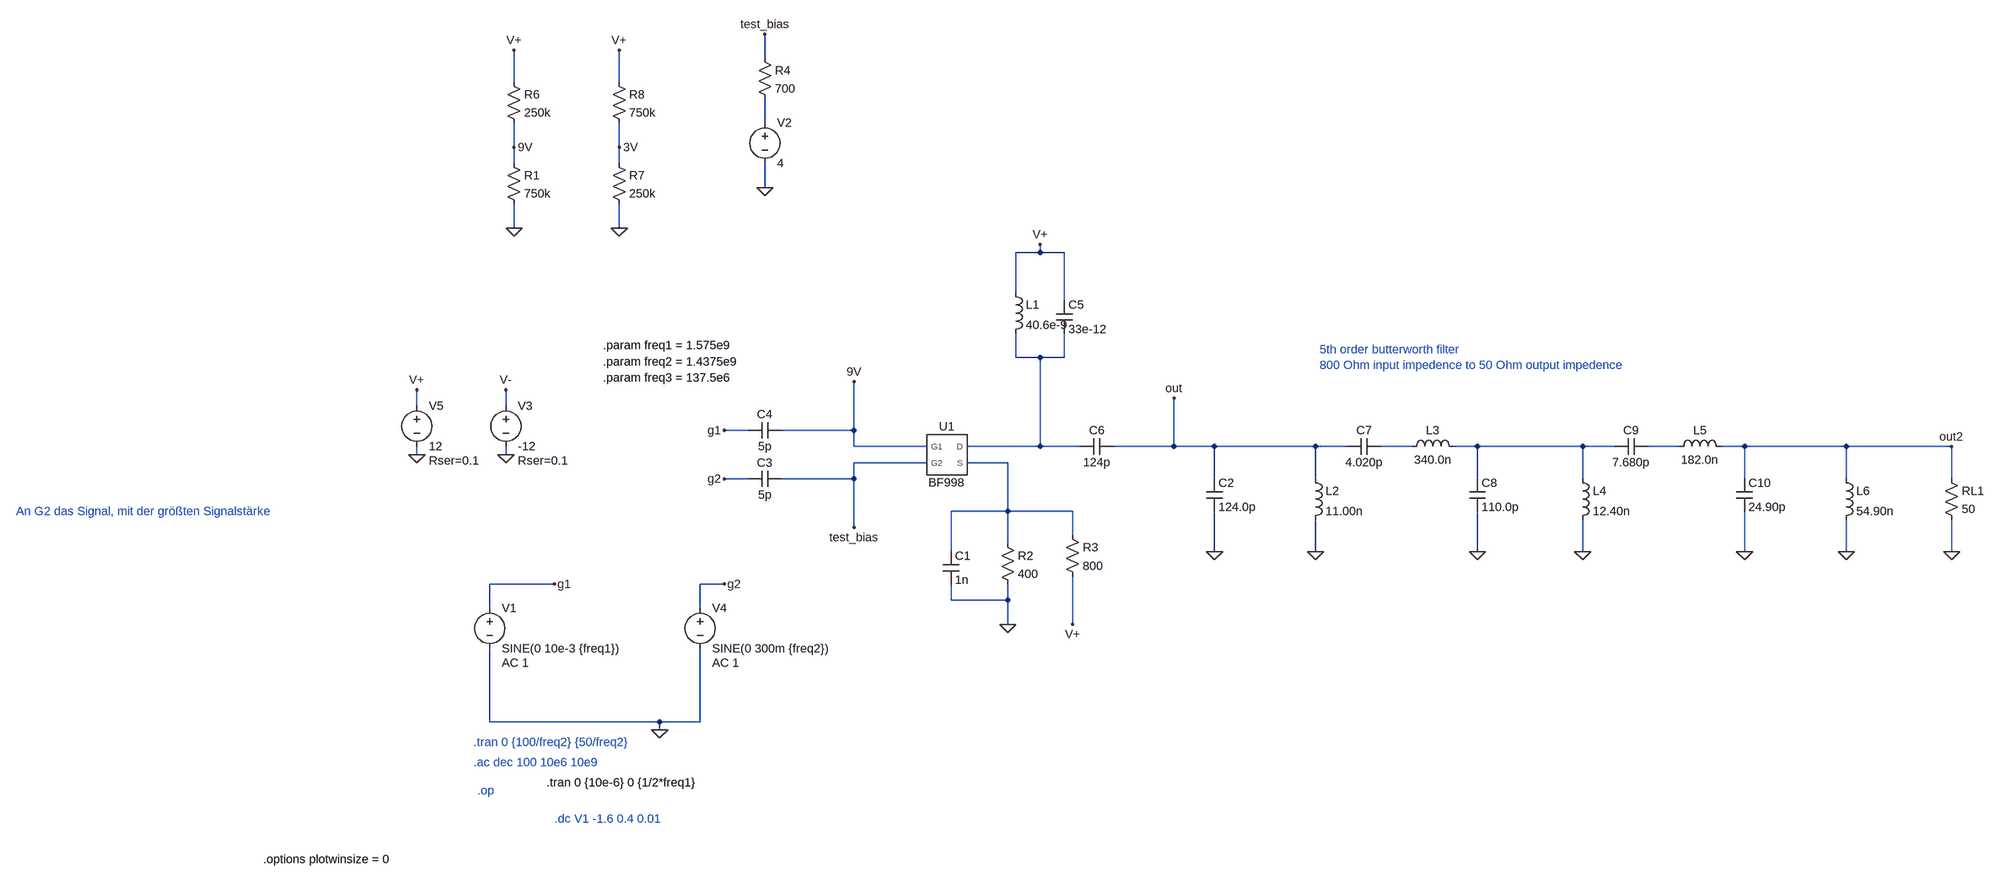
[diagram p0: schematic bf998_2.asc]
bf998_2.asc, the LTspice schematic file:
Version 4
SHEET 1 2012 1520
WIRE -656 -112 -656 -160
WIRE -1152 -64 -1152 -128
WIRE -944 -64 -944 -128
WIRE -656 16 -656 -32
WIRE -1152 64 -1152 16
WIRE -944 64 -944 16
WIRE -1152 96 -1152 64
WIRE -944 96 -944 64
WIRE -656 144 -656 96
WIRE -1152 224 -1152 176
WIRE -944 224 -944 176
WIRE -112 272 -112 256
WIRE -112 272 -160 272
WIRE -64 272 -112 272
WIRE -160 352 -160 272
WIRE -64 368 -64 272
WIRE -160 480 -160 432
WIRE -112 480 -160 480
WIRE -64 480 -64 432
WIRE -64 480 -112 480
WIRE -1344 576 -1344 544
WIRE -1168 576 -1168 544
WIRE -688 624 -736 624
WIRE -480 624 -480 528
WIRE -480 624 -624 624
WIRE -480 656 -480 624
WIRE -336 656 -480 656
WIRE -112 656 -112 480
WIRE -112 656 -256 656
WIRE -32 656 -112 656
WIRE 176 656 176 560
WIRE 176 656 32 656
WIRE 256 656 176 656
WIRE 464 656 256 656
WIRE 528 656 464 656
WIRE 656 656 592 656
WIRE 784 656 736 656
WIRE 992 656 784 656
WIRE 1056 656 992 656
WIRE 1184 656 1120 656
WIRE 1312 656 1264 656
WIRE 1520 656 1312 656
WIRE 1728 656 1520 656
WIRE -1344 672 -1344 656
WIRE -1168 672 -1168 656
WIRE -336 688 -480 688
WIRE -176 688 -256 688
WIRE -688 720 -736 720
WIRE -480 720 -480 688
WIRE -480 720 -624 720
WIRE 256 720 256 656
WIRE 464 720 464 656
WIRE 784 720 784 656
WIRE 992 720 992 656
WIRE 1312 720 1312 656
WIRE 1520 720 1520 656
WIRE 1728 720 1728 656
WIRE -176 784 -176 688
WIRE -176 784 -288 784
WIRE -48 784 -176 784
WIRE -480 816 -480 720
WIRE -48 832 -48 784
WIRE -176 848 -176 784
WIRE -288 864 -288 784
WIRE 256 864 256 784
WIRE 464 864 464 800
WIRE 784 864 784 784
WIRE 992 864 992 800
WIRE 1312 864 1312 784
WIRE 1520 864 1520 800
WIRE 1728 864 1728 800
WIRE -1072 928 -1200 928
WIRE -736 928 -784 928
WIRE -288 960 -288 928
WIRE -176 960 -176 928
WIRE -176 960 -288 960
WIRE -1200 976 -1200 928
WIRE -784 976 -784 928
WIRE -176 1008 -176 960
WIRE -48 1008 -48 912
WIRE -1200 1232 -1200 1056
WIRE -864 1232 -1200 1232
WIRE -784 1232 -784 1056
WIRE -784 1232 -864 1232
WIRE -864 1248 -864 1232
FLAG -864 1248 0
FLAG -1344 672 0
FLAG -1072 928 g1
FLAG -736 928 g2
FLAG 176 560 out
FLAG -736 624 g1
FLAG -1344 544 V+
FLAG -112 256 V+
FLAG -176 1008 0
FLAG -736 720 g2
FLAG -48 1008 V+
FLAG -1152 224 0
FLAG -1152 -128 V+
FLAG -1152 64 9V
FLAG -480 528 9V
FLAG -944 224 0
FLAG -944 -128 V+
FLAG -944 64 3V
FLAG -656 144 0
FLAG -656 -160 test_bias
FLAG -480 816 test_bias
FLAG -1168 672 0
FLAG -1168 544 V-
FLAG 256 864 0
FLAG 464 864 0
FLAG 784 864 0
FLAG 992 864 0
FLAG 1312 864 0
FLAG 1520 864 0
FLAG 1728 864 0
FLAG 1728 656 out2
SYMBOL voltage -1200 960 R0
WINDOW 123 24 124 Left 2
WINDOW 39 0 0 Left 0
SYMATTR Value2 AC 1
SYMATTR InstName V1
SYMATTR Value SINE(0 10e-3 {freq1})
SYMBOL voltage -1344 560 R0
WINDOW 123 0 0 Left 0
WINDOW 39 24 124 Left 2
SYMATTR SpiceLine Rser=0.1
SYMATTR InstName V5
SYMATTR Value 12
SYMBOL BF998 -304 672 R0
SYMATTR InstName U1
SYMBOL res -192 832 R0
SYMATTR InstName R2
SYMATTR Value 400
SYMBOL voltage -784 960 R0
WINDOW 123 24 124 Left 2
WINDOW 39 0 0 Left 0
SYMATTR Value2 AC 1
SYMATTR InstName V4
SYMATTR Value SINE(0 300m {freq2})
SYMBOL res -64 816 R0
SYMATTR InstName R3
SYMATTR Value 800
SYMBOL cap -304 864 R0
SYMATTR InstName C1
SYMATTR Value 1n
SYMBOL cap -624 704 R90
WINDOW 0 0 32 VBottom 2
WINDOW 3 32 32 VTop 2
SYMATTR InstName C3
SYMATTR Value 5p
SYMBOL cap -624 608 R90
WINDOW 0 0 32 VBottom 2
WINDOW 3 32 32 VTop 2
SYMATTR InstName C4
SYMATTR Value 5p
SYMBOL ind -176 336 R0
SYMATTR InstName L1
SYMATTR Value 40.6e-9
SYMBOL cap -80 368 R0
SYMATTR InstName C5
SYMATTR Value 33e-12
SYMBOL res -1168 80 R0
SYMATTR InstName R1
SYMATTR Value 750k
SYMBOL res -1168 -80 R0
SYMATTR InstName R6
SYMATTR Value 250k
SYMBOL res -960 80 R0
SYMATTR InstName R7
SYMATTR Value 250k
SYMBOL res -960 -80 R0
SYMATTR InstName R8
SYMATTR Value 750k
SYMBOL voltage -656 0 R0
WINDOW 123 0 0 Left 0
WINDOW 39 0 0 Left 0
SYMATTR InstName V2
SYMATTR Value 4
SYMBOL res -672 -128 R0
SYMATTR InstName R4
SYMATTR Value 700
SYMBOL voltage -1168 560 R0
WINDOW 123 0 0 Left 0
WINDOW 39 24 124 Left 2
SYMATTR SpiceLine Rser=0.1
SYMATTR InstName V3
SYMATTR Value -12
SYMBOL cap 240 720 R0
SYMATTR InstName C2
SYMATTR Value 124.0p
SYMBOL ind 448 704 R0
SYMATTR InstName L2
SYMATTR Value 11.00n
SYMBOL cap 528 672 R270
WINDOW 0 32 32 VTop 2
WINDOW 3 0 32 VBottom 2
SYMATTR InstName C7
SYMATTR Value 4.020p
SYMBOL ind 640 672 R270
WINDOW 0 32 56 VTop 2
WINDOW 3 5 56 VBottom 2
SYMATTR InstName L3
SYMATTR Value 340.0n
SYMBOL cap 768 720 R0
SYMATTR InstName C8
SYMATTR Value 110.0p
SYMBOL ind 976 704 R0
SYMATTR InstName L4
SYMATTR Value 12.40n
SYMBOL cap 1056 672 R270
WINDOW 0 32 32 VTop 2
WINDOW 3 0 32 VBottom 2
SYMATTR InstName C9
SYMATTR Value 7.680p
SYMBOL ind 1168 672 R270
WINDOW 0 32 56 VTop 2
WINDOW 3 5 56 VBottom 2
SYMATTR InstName L5
SYMATTR Value 182.0n
SYMBOL cap 1296 720 R0
SYMATTR InstName C10
SYMATTR Value 24.90p
SYMBOL ind 1504 704 R0
SYMATTR InstName L6
SYMATTR Value 54.90n
SYMBOL res 1712 704 R0
SYMATTR InstName RL1
SYMATTR Value 50
SYMBOL cap 32 640 R90
WINDOW 0 0 32 VBottom 2
WINDOW 3 32 32 VTop 2
SYMATTR InstName C6
SYMATTR Value 124p
TEXT -976 488 Left 2 !.param freq2 = 1.4375e9
TEXT -976 456 Left 2 !.param freq1 = 1.575e9
TEXT -1232 1272 Left 2 ;.tran 0 {100/freq2} {50/freq2}
TEXT -1232 1312 Left 2 ;.ac dec 100 10e6 10e9
TEXT -1224 1368 Left 2 ;.op
TEXT -976 520 Left 2 !.param freq3 = 137.5e6
TEXT -1088 1352 Left 2 !.tran 0 {10e-6} 0 {1/2*freq1}
TEXT -1072 1424 Left 2 ;.dc V1 -1.6 0.4 0.01
TEXT -2136 784 Left 2 ;An G2 das Signal, mit der größten Signalstärke
TEXT -1648 1504 Left 2 !.options plotwinsize = 0
TEXT 472 464 Left 2 ;5th order butterworth filter\n800 Ohm input impedence to 50 Ohm output impedence

The netlist it stands for:
* bf998_2.asc
V1 g1 0 SINE(0 10e-3 {freq1}) AC 1
V5 V+ 0 12 Rser=0.1
XU1 N006 N002 test_bias 9V BF998  ; pins S D G2 G1
R2 N006 0 400
V4 g2 0 SINE(0 300m {freq2}) AC 1
R3 N006 V+ 800
C1 N006 0 1n
C3 test_bias g2 5p
C4 9V g1 5p
L1 V+ N002 40.6e-9
C5 V+ N002 33e-12
R1 9V 0 750k
R6 V+ 9V 250k
R7 3V 0 250k
R8 V+ 3V 750k
V2 N001 0 4
R4 test_bias N001 700
V3 V- 0 -12 Rser=0.1
C2 out 0 124.0p
L2 out 0 11.00n
C7 out N003 4.020p
L3 N003 N004 340.0n
C8 N004 0 110.0p
L4 N004 0 12.40n
C9 N004 N005 7.680p
L5 N005 out2 182.0n
C10 out2 0 24.90p
L6 out2 0 54.90n
RL1 out2 0 50
C6 out N002 124p
.param freq2 = 1.4375e9
.param freq1 = 1.575e9
* .tran 0 {100/freq2} {50/freq2}
* .ac dec 100 10e6 10e9
* .op
.param freq3 = 137.5e6
.tran 0 {10e-6} 0 {1/2*freq1}
* .dc V1 -1.6 0.4 0.01
* An G2 das Signal, mit der größten Signalstärke
.options plotwinsize = 0
* 5th order butterworth filter
* 800 Ohm input impedence to 50 Ohm output impedence
.lib BF998.lib
.backanno
.end